# EAGLE design tempsens_tsys01 (EAGLE 7.5.0)
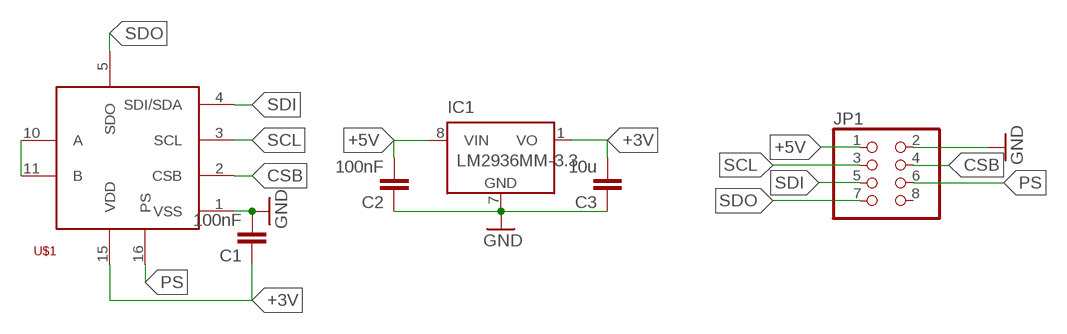
[diagram p0: schematic, sheet 1]

## Parts
C1  100nF  C-EUC0603K  [C0603K]
C2  100nF  C-EUC0603K  [C0603K]
C3  10u  C-EUC0805  [C0805]
IC1  LM2936MM-3.3  [MINI-SO8]
JP1  PINHD-2X4_2.00  [2X04M]
U$1  TSYS01NOPAD  [TSYS01_NOPAD]

## Nets
+3V: C1.1 C3.2 IC1.1(VO) U$1.15(VDD)
+5V: C2.2 IC1.8(VIN) JP1.1
CSB: JP1.4 U$1.2(CSB)
GND: C1.2 C2.1 C3.1 IC1.7(GND) JP1.2 U$1.1(VSS)
N$3: U$1.10(A) U$1.11(B)
PS: JP1.6 U$1.16(PS)
SCL: JP1.3 U$1.3(SCL)
SDI: JP1.5 U$1.4(SDI/SDA)
SDO: JP1.7 U$1.5(SDO)
Unconnected: JP1.8

## Library data of the parts
C1 C2 = resistor:C-EU: CAPACITOR, European symbol
C3 = rcl:C-EU: CAPACITOR, European symbol
IC1 = national-semiconductor:LM2936?*: Ultra-Low Quiescent Current LDO Voltage Regulator Source: Data sheet <http://www.national.com/ds/LM/LM2936.pdf>; MF: NATIONAL SEMICONDUCTOR; MPN: LM2936MM-3.3/NOPB; OC_FARNELL: 1312706; OC_NEWARK: 41K4517
JP1 = pinhead:PINHD-2X4: PIN HEADER
U$1 = meas:TSYS01

## Board
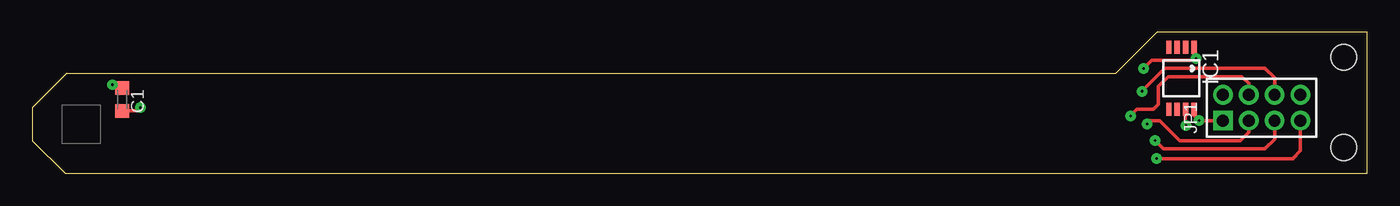
[diagram p1: board, top side]
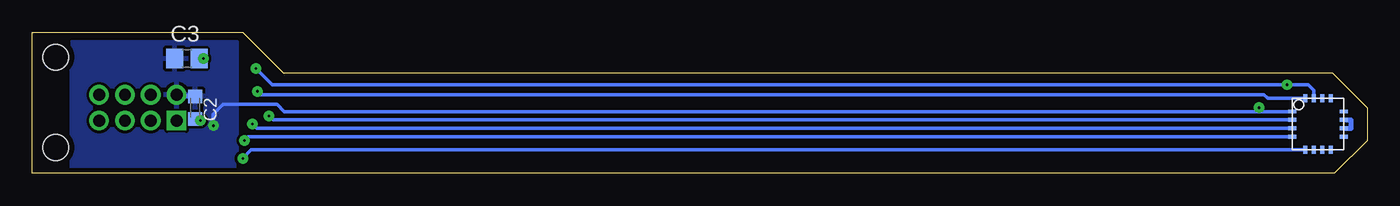
[diagram p2: board, bottom side, seen from below]

Size 103.43 x 10.92 mm. Coordinates in mm from the lower left corner, seen from the top.
Outline: 2.54,0 103.43,0 103.43,10.91 87.12,10.92 83.95,7.75 2.68,7.75 0,5.07 0,2.54 2.54,0
Copper layers (1*16): Top 0.035mm / dielectric 1.5mm / Bottom 0.035mm
Design rules "Fine8_lpt": minimum track width 8mil, minimum drill 8mil, track to track 8mil, track to pad 8mil, pad to pad 8mil, via to via 8mil, smd to smd 0mil, copper to edge 16mil, drill to drill 8mil, minimum pad ring 12mil, minimum via ring 12mil, stop-mask expansion 4mil, vias tented up to drill 0mil, thermal gap 10mil
Holes 2 mm at 101.6,9 101.6,2

### Footprints (pad centres in the part's own frame; a part is rotated, then mirrored left to right if it is on the bottom)
C0603K = smd 1.05 x 1.08: 1 -0.875,0; 2 0.875,0
C0805 = smd 1.3 x 1.5: 1 -0.95,0; 2 0.95,0
MINI-SO8 = smd 0.41 x 1.02: 1 -0.975,-2.4; 2 -0.325,-2.4; 3 0.325,-2.4; 4 0.975,-2.4; 5 0.975,2.4; 6 0.325,2.4; 7 -0.325,2.4; 8 -0.975,2.4
2X04M = drill 0.914 square: 1 -3,-1 | drill 0.914: 2 -3,1; 3 -1,-1; 4 -1,1; 5 1,-1; 6 1,1; 7 3,-1; 8 3,1
TSYS01_NOPAD = smd 0.305 x 0.61: 1 -0.975,-2; 2 -0.325,-2; 3 0.325,-2; 4 0.975,-2; 9 0.975,2; 10 0.325,2; 11 -0.325,2; 12 -0.975,2 | smd 0.61 x 0.305: 5 2,-0.975; 6 2,-0.325; 7 2,0.325; 8 2,0.975; 13 -2,0.975; 14 -2,0.325; 15 -2,-0.325; 16 -2,-0.975

### Placement (x,y rotation side)
C1  6.99,5.71 270 top
C2  90.81,5.08 270 bottom
C3  91.44,8.89 0 bottom
IC1  89.03,7.37 180 top
JP1  95.25,5.08 0 top
U$1  3.81,3.81 270 bottom

### Tracks (layer width: path | path; a pad name or v marks a point on that pad's centre or on a via)
+3V  (via drill 0.2)
  Top 0.254: v6.22,6.86 6.72,6.86 | 90,9.87 IC1.1 90,8.98 | v86.11,8.13 86.74,8.76 89.79,8.76 90,8.98 | v90.17,8.89 90.09,8.89 90,8.98
  Top 0.406: 7.35,6.59 C1.1 6.72,6.86
  Bottom 0.254: U$1.15 4.13,6.42 4.57,6.86 v6.22,6.86 84.84,6.86 v86.11,8.13 | C3.2 v90.17,8.89
+5V  (via drill 0.2)
  Top 0.254: IC1.8 90,4.49 v90.41,4.08 JP1.1
  Bottom 0.254: v90.41,4.08 90.68,4.08 C2.2
CSB  (via drill 0.2)
  Top 0.254: JP1.4 94.25,6.97 93.73,7.49 88.01,7.49 87.25,6.73 87.25,5.33 86.87,4.95 85.6,4.95 v85.09,4.45
  Bottom 0.254: U$1.2 84.78,4.13 v85.09,4.45
GND  (via drill 0.2)
  Top 0.254: C1.2 8.14,4.84 v8.38,5.08 | IC1.7 89.35,3.74 v89.41,3.68
  Bottom 0.254: U$1.1 8.38,4.79 | 8.38,4.79 83.91,4.79 84.45,5.33 88.65,5.33 89.41,4.57 v89.41,3.68 | v8.38,5.08 8.38,4.79
  Bottom 0.406: C2.1 92.12,5.96 JP1.2
  pour Bottom: 87.63,10.16 87.63,0 100.33,0 100.33,10.16
N$3
  Bottom 0.406: U$1.10 1.27,3.48 1.27,4.13 U$1.11
PS  (via drill 0.2)
  Top 0.254: v85.98,6.35 87.76,8.13 95.5,8.13 96.25,7.38 JP1.6
  Bottom 0.254: U$1.16 7.71,5.81 8,6.1 85.73,6.1 v85.98,6.35
SCL  (via drill 0.2)
  Top 0.254: v86.36,3.81 86.63,4.08 87.36,4.08 88.9,2.54 93.6,2.54 94.25,3.19 JP1.3
  Bottom 0.254: U$1.3 86.04,3.48 v86.36,3.81
SDI  (via drill 0.2)
  Top 0.254: v87,2.54 87.63,1.91 95.5,1.91 96.25,2.65 JP1.5
  Bottom 0.254: U$1.4 86.7,2.83 v87,2.54
SDO  (via drill 0.2)
  Top 0.254: v87.12,1.14 97.66,1.14 98.25,1.73 JP1.7
  Bottom 0.254: U$1.5 86.45,1.81 v87.12,1.14